# Altium schematic sheet kapuas.SchDoc
size A3; PageSetup: Record=PageOptions|CenterHorizontal=True|CenterVertical=True|PrintScale=1.00|XCorrection=1.00|YCorrection=1.00|PrintKind=1|BorderSize=5000000|LeftOffset=0|BottomOffset=0|Orientation=2|PaperLength=1000|PaperWidth=1000|Scale=100|PaperSource=7|PrintQuality=-4|MediaType=1|DitherType=10|PaperKind=A3|PrintScaleMode=1
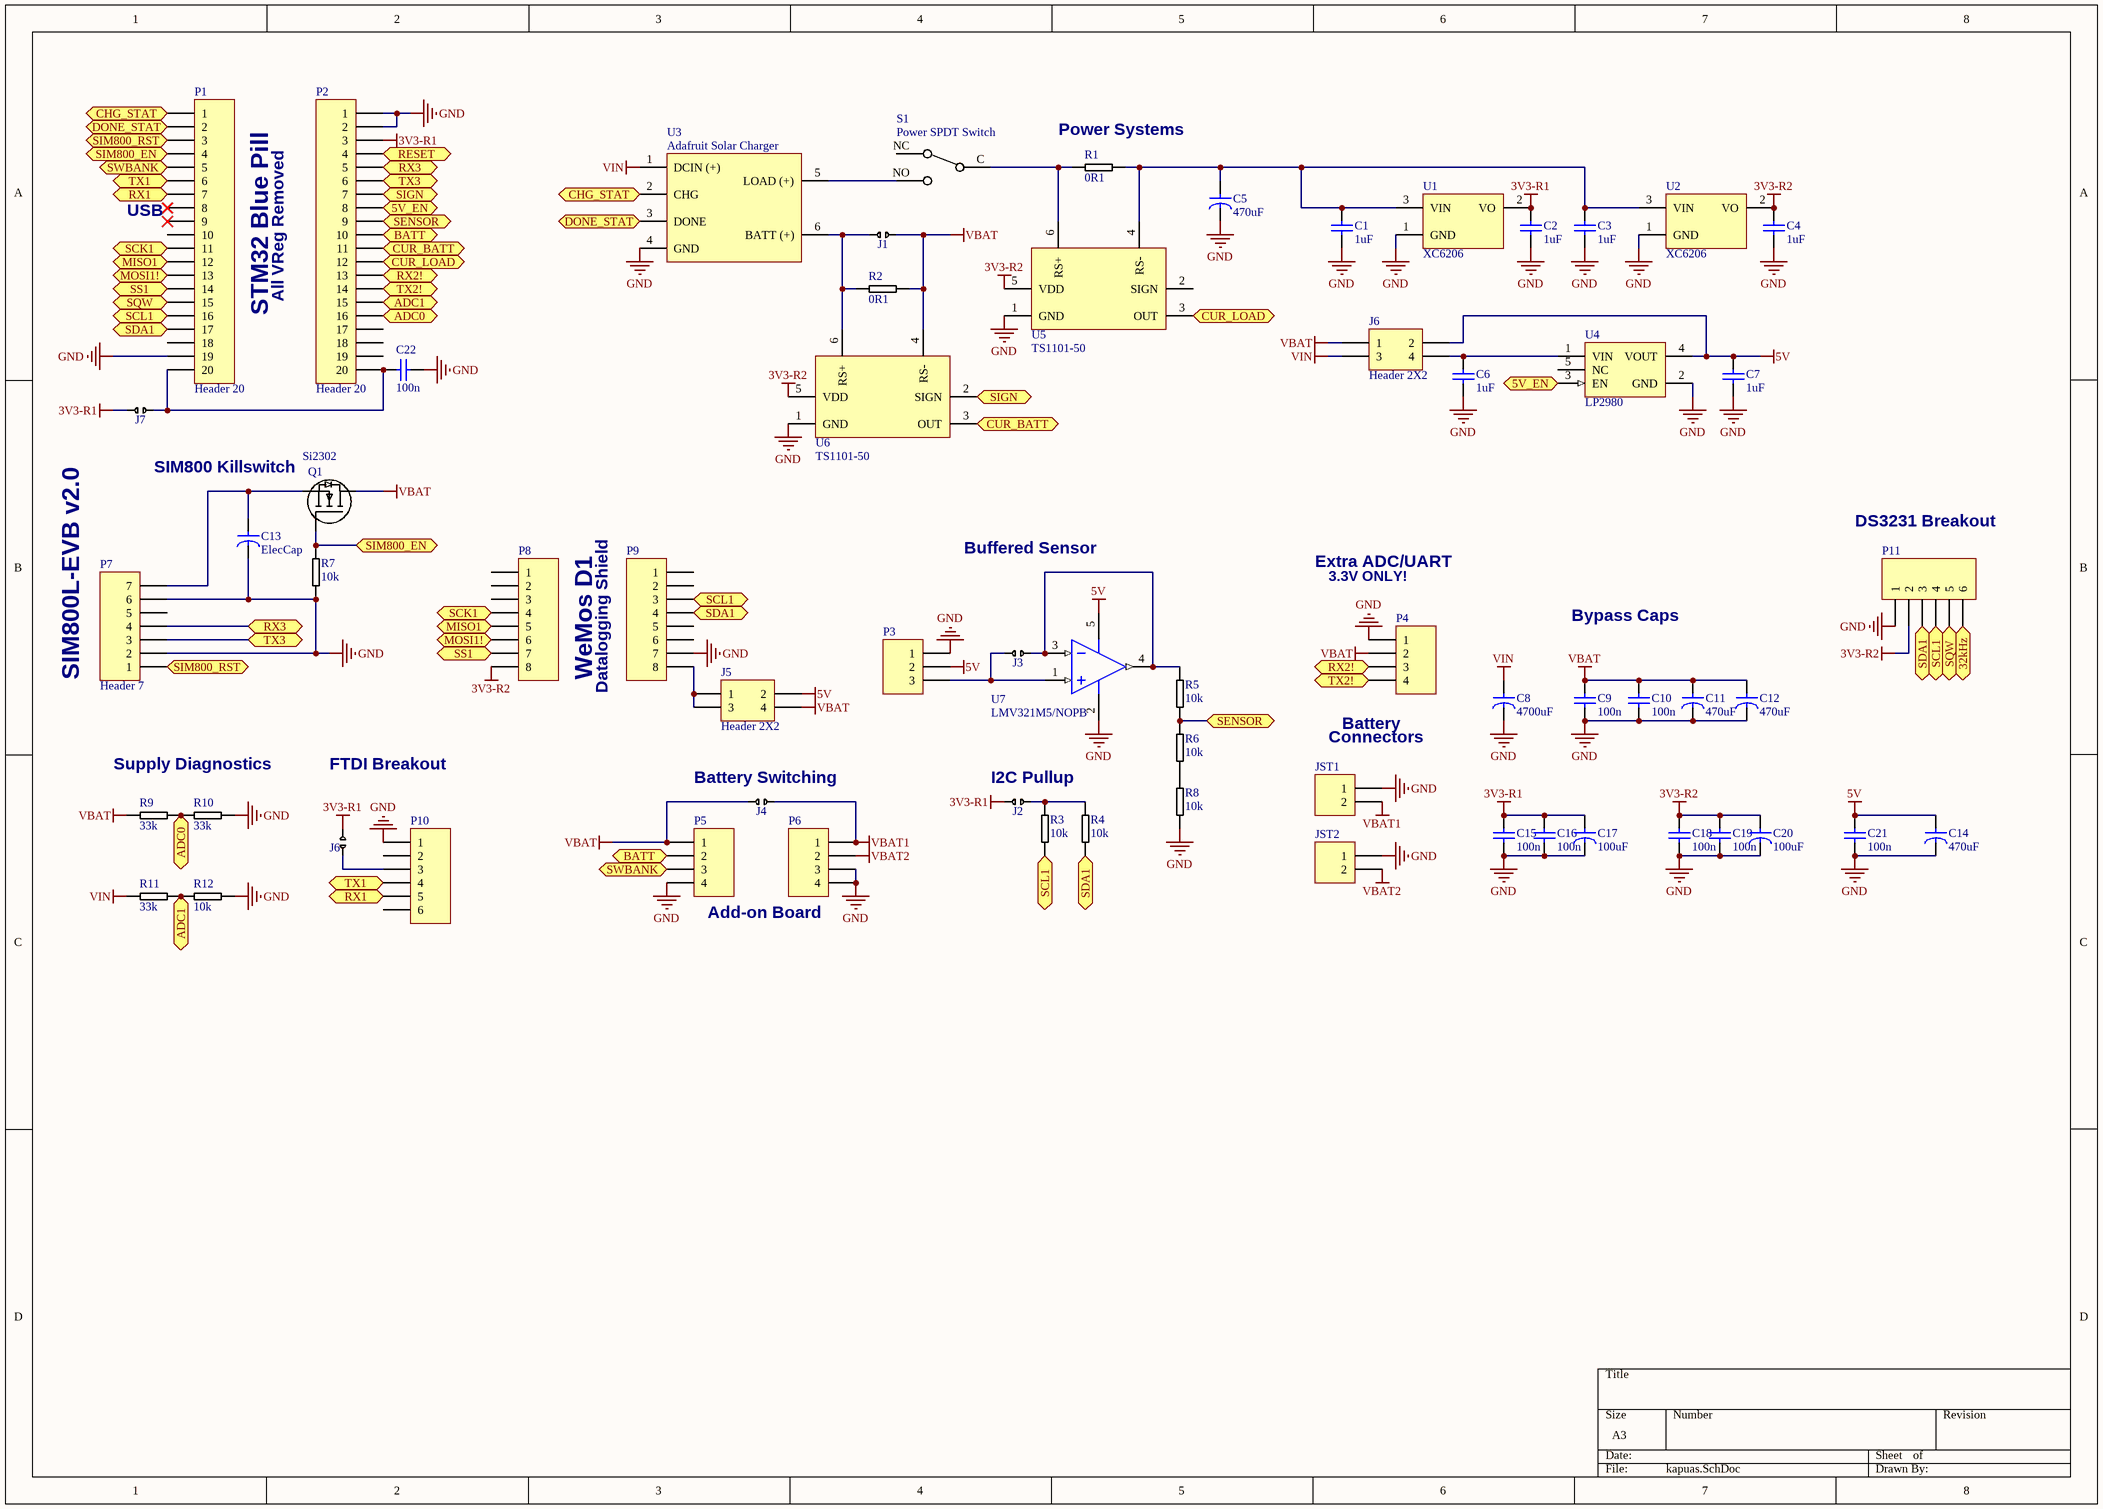
[diagram p0: kapuas.SchDoc]

## Parts
(Parts that share a designator on the sheet are numbered #1, #2 ... from top to bottom, then left to right.)
C1  1uF  [0805C]
C2  1uF  [0805C]
C3  1uF  [0805C]
C4  1uF  [0805C]
C5  470uF  [RadCap5mmV]
C6  1uF  [0805C]
C7  1uF  [0805C]
C8  4700uF  [RadCap5mmV]
C9  100n  [0805C]
C10  100n  [0805C]
C11  470uF  [RadCap5mmV]
C12  470uF  [RadCap5mmV]
C13  ElecCap  [RadCap5mmV]
C14  470uF  [RadCap5mmV]
C15  100n  [0805C]
C16  100n  [0805C]
C17  100uF  [RadCap5mmV]
C18  100n  [0805C]
C19  100n  [0805C]
C20  100uF  [RadCap5mmV]
C21  100n  [0805C]
C22  100n  [0805C]
J1  Jumper  [HDR1X2]  (value not drawn)
J2  Jumper  [HDR1X2]  (value not drawn)
J3  Jumper  [HDR1X2]  (value not drawn)
J4  Jumper  [HDR1X2]  (value not drawn)
J5  Header 2X2  [HDR2X2]
J6#1  Header 2X2  [HDR2X2]
J6#2  Jumper  [HDR1X2]  (value not drawn)
J7  Jumper  [HDR1X2]  (value not drawn)
JST1  (no value)  [HDR1X2]
JST2  (no value)  [HDR1X2]
P1  Header 20  [HDR1X20]
P2  Header 20  [HDR1X20]
P3  (no value)  [HDR1X3]
P4  (no value)  [HDR1X4]
P5  (no value)  [HDR1X4]
P6  (no value)  [HDR1X4]
P7  Header 7  [HDR1X7]
P8  (no value)  [HDR1X8]
P9  (no value)  [HDR1X8]
P10  (no value)  [HDR1X6]
P11  (no value)  [HDR1X6]
Q1  Si2302  [SOT-23 Si2302]
R1  0R1  [RES1206S]
R2  0R1  [RES1206S]
R3  10k  [RES1206S]
R4  10k  [RES1206S]
R5  10k  [RES1206S]
R6  10k  [RES1206S]
R7  10k  [RES1206S]
R8  10k  [RES1206S]
R9  33k  [RES1206S]
R10  33k  [RES1206S]
R11  33k  [RES1206S]
R12  10k  [RES1206S]
S1  Power SPDT Switch  [SPDT-POW]
U1  XC6206  [SOT-23 XC6206]
U2  XC6206  [SOT-23 XC6206]
U3  Adafruit Solar Charger  [AdaSolar]
U4  LP2980  [SOT-23-5 LP2980]
U5  TS1101-50  [SOT23-6]
U6  TS1101-50  [SOT23-6]
U7  LMV321M5/NOPB  [MF05A_N]

## Ports
5V_EN (bidir), 32kHz (bidir), ADC0 (bidir), ADC1 (bidir), BATT (bidir), CHG_STAT (bidir), CUR_BATT (bidir), CUR_LOAD (bidir), DONE_STAT (bidir), MISO1 (bidir), MOSI1! (bidir), RESET (bidir), RX1 (bidir), RX2! (bidir), RX3 (bidir), SCK1 (bidir), SCL1 (bidir), SDA1 (bidir), SENSOR (bidir), SIGN (bidir), SIM800_EN (bidir), SIM800_RST (bidir), SQW (bidir), SS1 (bidir), SWBANK (bidir), TX1 (bidir), TX2! (bidir), TX3 (bidir)

## Nets
3V3-R1: C2.2 C15.2 C16.2 C17.1 J2.1 J6#2.2 J7.1 P2.3 U1.2(VO)
3V3-R2: C4.2 C18.2 C19.2 C20.1 P8.8 P11.2 U2.2(VO) U5.5(VDD) U6.5(VDD)
5V: C7.2 C14.1 C21.2 J5.2 J6#1.2 P3.2 U4.4(VOUT) U7.5(V+)
GND: C1.1 C2.1 C3.1 C4.1 C5.2 C6.1 C7.1 C8.2 C9.1 C10.1 C11.2 C12.2 C13.2 C14.2 C15.1 C16.1 C17.2 C18.1 C19.1 C20.2 C21.1 C22.1 JST1.1 JST2.1 P1.19 P2.1 P2.2 P3.1 P4.1 P5.4 P6.3 P6.4 P7.2 P7.6 P9.7 P10.1 P11.1 R7.1 R8.1 R10.1 R12.1 U1.1(GND) U2.1(GND) U3.4(GND) U4.2(GND) U5.1(GND) U6.1(GND) U7.2(V-)
VBAT: C9.2 C10.2 C11.1 C12.1 J1.2 J4.1 J5.4 J6#1.1 P4.2 P5.1 Q1.2 R2.2 R9.2 U6.4(RS-)
VBAT1: J4.2 JST1.2 P6.1
VBAT2: JST2.2 P6.2
VIN: C8.1 J6#1.3 R11.2 U3.1(DCIN_(+))
5V_EN: P2.8 U4.3(EN) ; port 5V_EN
32kHz: P11.6 ; port 32kHz
ADC0: P2.16 R9.1 R10.2 ; port ADC0
ADC1: P2.15 R11.1 R12.2 ; port ADC1
BATT: P2.10 P5.2 ; port BATT
CHG_STAT: P1.1 U3.2(CHG) ; port CHG_STAT
CUR_BATT: P2.11 U6.3(OUT) ; port CUR_BATT
CUR_LOAD: P2.12 U5.3(OUT) ; port CUR_LOAD
DONE_STAT: P1.2 U3.3(DONE) ; port DONE_STAT
MISO1: P1.12 P8.5 ; port MISO1
MOSI1!: P1.13 P8.6 ; port MOSI1!
RESET: P2.4 ; port RESET
RX1: P1.7 P10.5 ; port RX1
RX2!: P2.13 P4.3 ; port RX2!
RX3: P2.5 P7.4 ; port RX3
SCK1: P1.11 P8.4 ; port SCK1
SCL1: P1.16 P9.3 P11.4 R3.1 ; port SCL1
SDA1: P1.17 P9.4 P11.3 R4.1 ; port SDA1
SENSOR: P2.9 R5.1 R6.2 ; port SENSOR
SIGN: P2.7 U6.2(SIGN) ; port SIGN
SIM800_EN: P1.4 Q1.1 R7.2 ; port SIM800_EN
SIM800_RST: P1.3 P7.1 ; port SIM800_RST
SQW: P1.15 P11.5 ; port SQW
SS1: P1.14 P8.7 ; port SS1
SWBANK: P1.5 P5.3 ; port SWBANK
TX1: P1.6 P10.4 ; port TX1
TX2!: P2.14 P4.4 ; port TX2!
TX3: P2.6 P7.3 ; port TX3
NetC1_2: C1.2 C3.2 C5.1 R1.2 U1.3(VIN) U2.3(VIN) U5.4(RS-)
NetC6_2: C6.2 J6#1.4 U4.1(VIN)
NetC13_1: C13.1 P7.7 Q1.3
NetC22_2: C22.2 J7.2 P1.20 P2.20
NetJ1_1: J1.1 R2.1 U3.6(BATT_(+)) U6.6(RS+)
NetJ2_2: J2.2 R3.2 R4.2
NetJ3_1: J3.1 P3.3 U7.1(IN+)
NetJ3_2: J3.2 R5.2 U7.3(IN-) U7.4(OUT)
NetJ5_1: J5.1 J5.3 P9.8
NetJ6#2_1: J6#2.1 P10.3
NetR1_1: R1.1 S1.C U5.6(RS+)
NetR6_1: R6.1 R8.2
NetS1_NO: S1.NO U3.5(LOAD_(+))

Not connected (* = marked no-connect by the designer): P1 8* 9* 10 18; P2 17 18 19; P7 5; P8 1 2 3; P9 1 2 5 6; P10 2 6; S1 NC; U4 5(NC); U5 2(SIGN)

## Notes on the sheet
- (near R1) Power Systems
- (near P1) USB
- STM32 Blue Pill
- All VReg Removed
- (near Q1) SIM800 Killswitch
- Buffered Sensor
- Extra ADC/UART
- 3.3V ONLY!
- DS3231 Breakout
- Bypass Caps
- SIM800L-EVB v2.0
- WeMos D1
- Datalogging Shield
- Supply Diagnostics
- FTDI Breakout
- (near J4) Battery Switching
- (near J2) I2C Pullup
- Connectors
- Battery
- Add-on Board

## Library data of the parts
C1-C4 C6 C7 C9 C10 C15 C16 C18 C19 C21 C22 = SMD-CAP: SMD Nonpolarized Ceramic Capacitor
C5 C8 C11-C14 C17 C20 = Cap - Electrolytic: Generic Thru-Hole Electrolytic Capacitor
J1-J4 J6#2 J7 = Jumper: Mini Jumpered Header
J5 J6#1 = Header 2X2: Header, 2-Pin, Dual row; LatestRevisionDate: 17-Jul-2002; LatestRevisionNote: Re-released for DXP Platform.; Publisher: Altium Limited
JST1 JST2 = Header 2: Header, 2-Pin; LatestRevisionDate: 17-Jul-2002; LatestRevisionNote: Re-released for DXP Platform.; Publisher: Altium Limited
P1 P2 = Header 20: Header, 20-Pin; LatestRevisionDate: 17-Jul-2002; LatestRevisionNote: Re-released for DXP Platform.; Publisher: Altium Limited
P3 = Header 3: Header, 3-Pin; LatestRevisionDate: 17-Jul-2002; LatestRevisionNote: Re-released for DXP Platform.; Publisher: Altium Limited
P4-P6 = Header 4: Header, 4-Pin; LatestRevisionDate: 17-Jul-2002; LatestRevisionNote: Re-released for DXP Platform.; Publisher: Altium Limited
P7 = Header 7: Header, 7-Pin; LatestRevisionDate: 17-Jul-2002; LatestRevisionNote: Re-released for DXP Platform.; Publisher: Altium Limited
P8 P9 = Header 8: Header, 8-Pin; LatestRevisionDate: 17-Jul-2002; LatestRevisionNote: Re-released for DXP Platform.; Publisher: Altium Limited
P10 P11 = Header 6: Header, 6-Pin; LatestRevisionDate: 17-Jul-2002; LatestRevisionNote: Re-released for DXP Platform.; Publisher: Altium Limited
Q1 = Si2302: Si2302 Logic Level MOSFET
R1-R12 = SMD-RES: SMD Resistor
S1 = SPDT Power Switch
U1 U2 = XC6206: 200mA Low IQ LDO
U4 = LP2980: 50mA Low IQ LDO w/ Enable
U5 U6 = TS1101: ULP Bidirectional Current Sensor
U7 = LMV321M5/NOPB: General Purpose, Low Voltage, Rail-to-Rail Output Operational Amplifiers, 5-pin SOT-23, Pb-Free; Manufacturer: National Semiconductor; PackageTopMarking: A13*XTT; PowerWise: N; High-Reliability: Y; DatasheetVersion: Sep-2009; PackageVersion: revD, Aug-2008; PackageReference: MF05A; PackageDescription: Molded SOT-23, .115 x .063 x .040 in Body, 5 Lead, .0375 in Pitch; PartNumber: LMV321M5/NOPB; RoHS: Y; PinCount: 5; CompType: Amplifiers; ComponentLink1Description: Manufacturer URL; ComponentLink1URL: http://www.national.com/; ComponentLink2Description: LMV321 Datasheet; ComponentLink2URL: http://www.national.com/ds/LM/LMV321.pdf; ComponentLink3Description: LMV321 Web Page; ComponentLink3URL: http://www.national.com/pf/LM/LMV321.html; ComponentLink4Description: MF05A Package Page; ComponentLink4URL: http://www.national.com/packaging/folders/mf05a.html